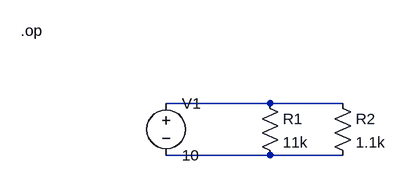
[diagram p0: schematic circuit.asc]
circuit.asc, the LTspice schematic file:
Version 4.1
SHEET 1 880 680
WIRE 208 128 48 128
WIRE 320 128 208 128
WIRE 208 208 48 208
WIRE 320 208 208 208
DATAFLAG 144 128 "round(-I(V1)*100)/100"
DATAFLAG 160 176 "round(I(R1)*1k)/1k"
DATAFLAG 416 176 "round(I(R2)*1k)/1k"
SYMBOL voltage 48 112 R0
WINDOW 123 0 0 Left 0
WINDOW 39 0 0 Left 0
SYMATTR InstName V1
SYMATTR Value 10
SYMBOL res 192 112 R0
SYMATTR InstName R1
SYMATTR Value 11k
SYMBOL res 304 112 R0
SYMATTR InstName R2
SYMATTR Value 1.1k
TEXT -176 16 Left 2 !.op

The netlist it stands for:
* circuit.asc
V1 N001 N002 10
R1 N001 N002 11k
R2 N001 N002 1.1k
.op
.backanno
.end